# EAGLE board 辉光钟V2 (EAGLE 9.3.1)
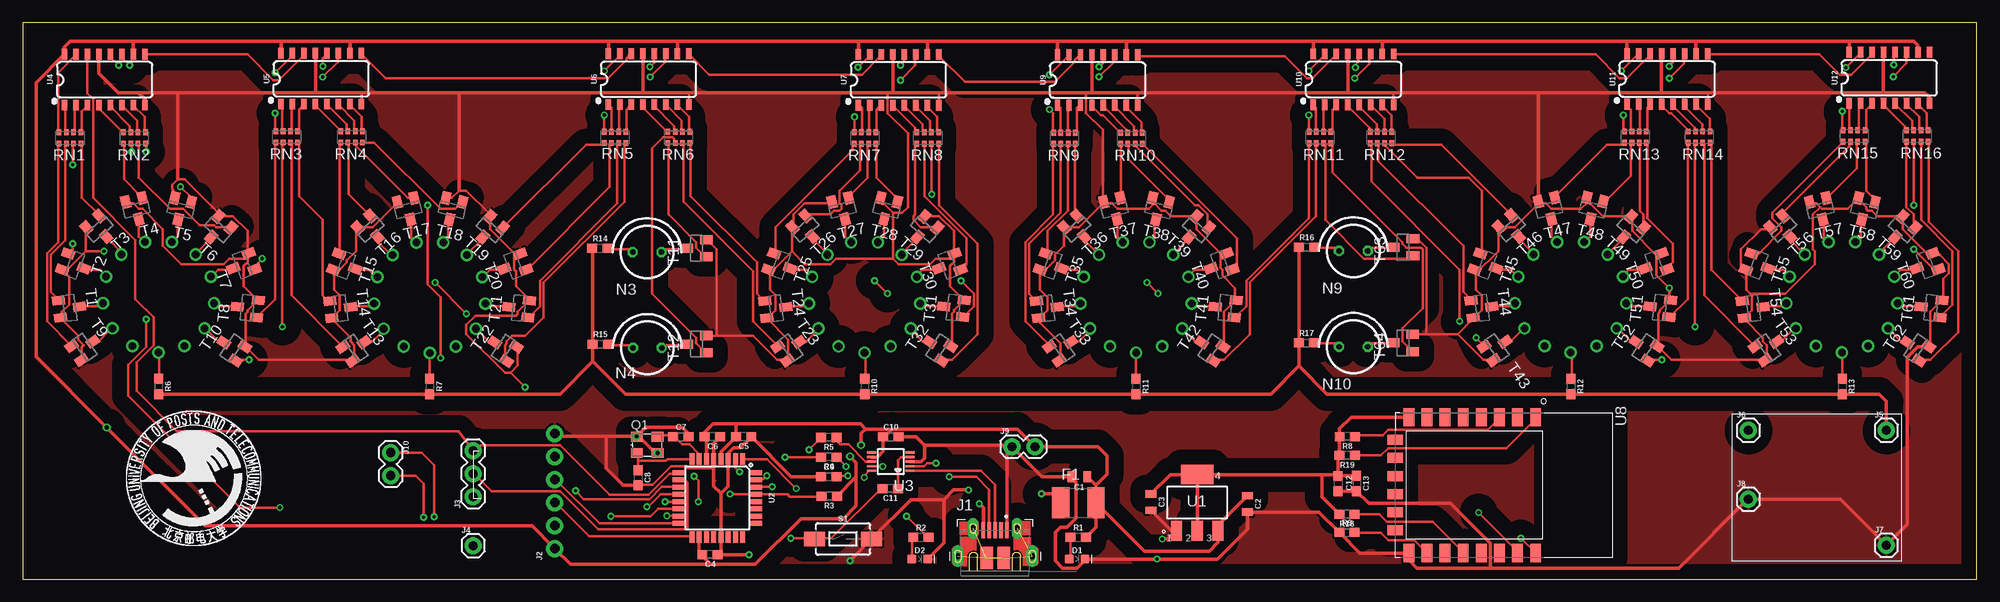
[diagram p5: board, top side]
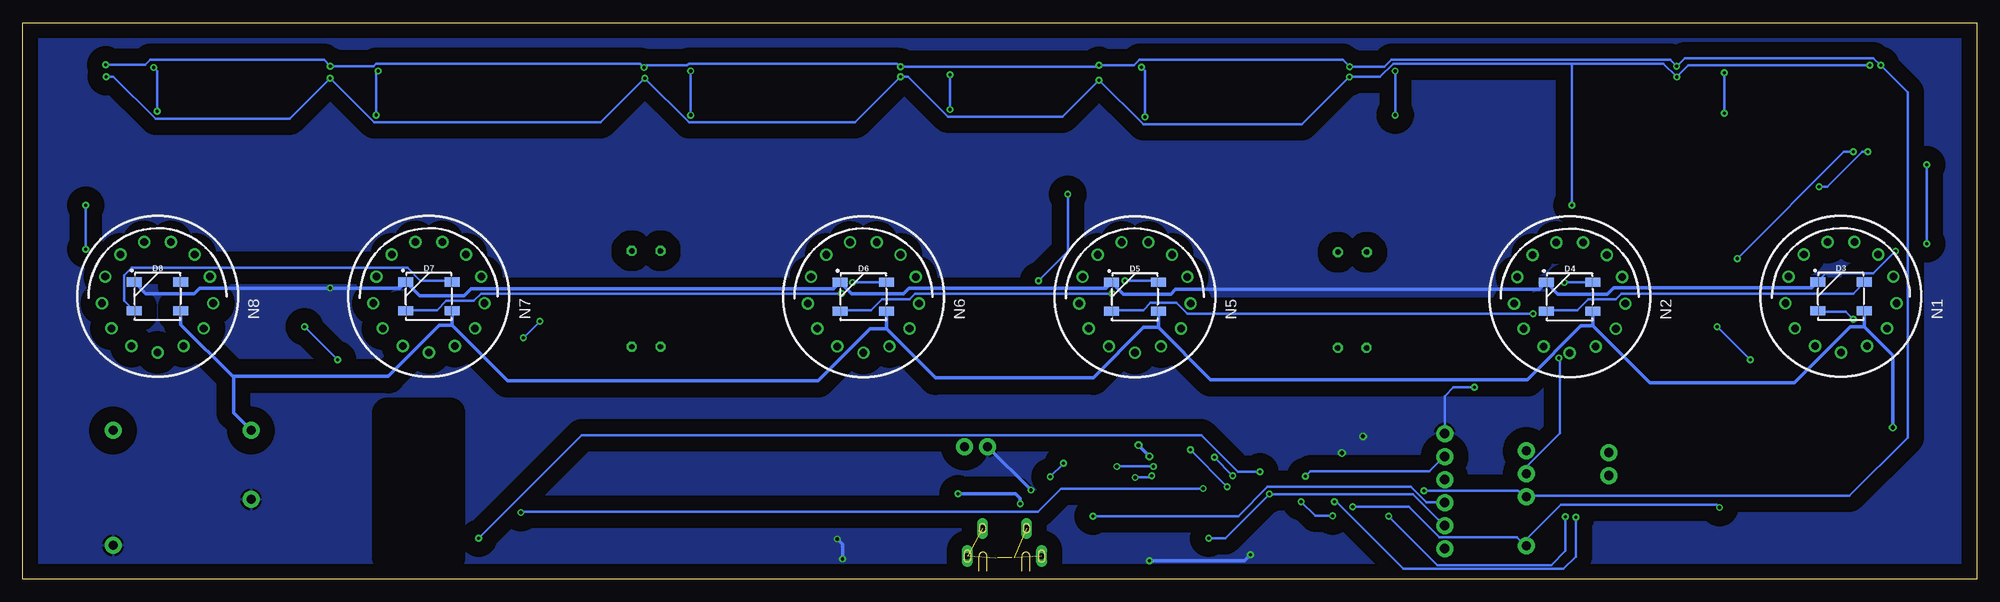
[diagram p6: board, bottom side, seen from below]

Size 215.9 x 61.47 mm. Coordinates in mm from the lower left corner, seen from the top.
Outline: 0,0 215.9,0 215.9,61.47 0,61.47 0,0
Copper layers (1*16): Top 0.035mm / dielectric 1.5mm / Bottom 0.035mm
Design rules "default *": minimum track width 10mil, minimum drill 0.35mm, track to track 6mil, track to pad 6mil, pad to pad 6mil, via to via 6mil, smd to smd 6mil, copper to edge 40mil, drill to drill 6mil, minimum pad ring 10mil, minimum via ring 8mil, stop-mask expansion 4mil, vias tented up to drill 0mil, thermal gap 10mil

## Footprints (pad centres in the part's own frame; a part is rotated, then mirrored left to right if it is on the bottom)
0805 = smd 0.8 x 1.2: 1 -0.9,0; 2 0.9,0
0603 = smd 1.1 x 1: 1 -0.85,0; 2 0.85,0
LED-0603 = smd 1 x 1: A -0.877,0; C 0.877,0
WS2812B = smd 1.651 x 1: 1 2.577,-1.6; 2 2.577,1.6; 3 -2.577,1.6; 4 -2.577,-1.6
FUSM1812X02 = smd 1.9 x 3.4: 1 -1.95,0; 2 1.95,0
AMPHENOL_10103592-0001LF = smd 0.4 x 1.75: 1 1.3,2.875; 2 0.65,2.875; 3 0,2.875; 4 -0.65,2.875; 5 -1.3,2.875 | drill 0.65 pad 0.8 long: P1 -2.425,3.08; P2 2.425,3.08 | drill 0.7 pad 1.05 long: P3 -4.1,0; P6 4.1,0 | smd 1.375 x 2.5: P4 -0.938,-0.2; P5 0.938,-0.2
1X06_NO_SILK = drill 1.016 pad 1.88: 1 0,0; 2 2.54,0; 3 5.08,0; 4 7.62,0; 5 10.16,0; 6 12.7,0
1X03 = drill 1.016 pad 1.88: 1 0,0; 2 2.54,0; 3 5.08,0
1X01 = drill 1.016 pad 1.88: 1 0,0
1X02 = drill 1.016 pad 1.88: 1 0,0; 2 2.54,0
IN-14 = drill 0.84: 0 5.094,-3.516; 1 -5.094,-3.516; 2 -6.145,-0.746; 3 -5.788,2.195; 4 -4.105,4.633; 5 -1.481,6.01; 6 1.481,6.01; 7 4.105,4.633; 8 5.788,2.195; 9 6.145,-0.746; A 0,-6.19; LHDP 2.877,-5.481; RHDP -2.877,-5.481
IN-3 = drill 0.6 octagon: A -1.587,0; K 1.587,0
3.2X2.5_KX-7 = smd 1.3 x 1.1: 1 -1.15,-0.9; 2 1.15,-0.9; 3 1.15,0.9; 4 -1.15,0.9
0603-ARC = smd 0.5 x 0.65: 1 -1.2,-0.625; 2 -0.4,-0.625; 3 0.4,-0.625; 4 1.2,-0.625; 5 1.2,0.625; 6 0.4,0.625; 7 -0.4,0.625; 8 -1.2,0.625
TACTILE_SWITCH_SMD_6.0X3.5MM = smd 2.3 x 1.6: 1 -3.15,0; 2 3.15,0
SOT23 = smd 1 x 1.4: 1 -0.95,-1.1; 2 0.95,-1.1; 3 0,1.1
SOT223 = smd 2.235 x 1.219: 1 -3.099,2.311; 2 -3.099,0; 3 -3.099,-2.311 | smd 2.2 x 3.6: 4 3.099,0
TQFP32-08 = smd 1.27 x 0.559: 1 -4.293,2.8; 2 -4.293,2; 3 -4.293,1.2; 4 -4.293,0.4; 5 -4.293,-0.4; 6 -4.293,-1.2; 7 -4.293,-2; 8 -4.293,-2.8; 17 4.293,-2.8; 18 4.293,-2; 19 4.293,-1.2; 20 4.293,-0.4; 21 4.293,0.4; 22 4.293,1.2; 23 4.293,2; 24 4.293,2.8 | smd 0.559 x 1.27: 9 -2.8,-4.293; 10 -2,-4.293; 11 -1.2,-4.293; 12 -0.4,-4.293; 13 0.4,-4.293; 14 1.2,-4.293; 15 2,-4.293; 16 2.8,-4.293; 25 2.8,4.293; 26 2,4.293; 27 1.2,4.293; 28 0.4,4.293; 29 -0.4,4.293; 30 -1.2,4.293; 31 -2,4.293; 32 -2.8,4.293
MSOP10 = smd 1 x 0.25: 1 -2.113,1; 2 -2.113,0.5; 3 -2.113,0; 4 -2.113,-0.5; 5 -2.113,-1; 6 2.113,-1; 7 2.113,-0.5; 8 2.113,0; 9 2.113,0.5; 10 2.113,1
SO16 = smd 0.6 x 1.2: 1 -4.445,-2.8; 2 -3.175,-2.8; 3 -1.905,-2.8; 4 -0.635,-2.8; 5 0.635,-2.8; 6 1.905,-2.8; 7 3.175,-2.8; 8 4.445,-2.8; 9 4.445,2.8; 10 3.175,2.8; 11 1.905,2.8; 12 0.635,2.8; 13 -0.635,2.8; 14 -1.905,2.8; 15 -3.175,2.8; 16 -4.445,2.8
XCVR_ESP8266-12E/ESP-12E = smd 2 x 1.2: 1 -7.5,7; 2 -7.5,5; 3 -7.5,3; 4 -7.5,1; 5 -7.5,-1; 6 -7.5,-3; 7 -7.5,-5; 8 -7.5,-7; 15 7.5,-7; 16 7.5,-5; 17 7.5,-3; 18 7.5,-1; 19 7.5,1; 20 7.5,3; 21 7.5,5; 22 7.5,7 | smd 1.1 x 1.7: 9 -5,-8.5; 10 -3,-8.5; 11 -1,-8.5; 12 1,-8.5; 13 3,-8.5; 14 5,-8.5

## Placement (x,y rotation side)
C1  22uF  [0805]  116.71,11.33 180 top
C2  22uF  [0805]  135.3,8.31 270 top
C3  22uF  [0805]  124.66,8.51 270 top
C4  100n  [0603]  75.94,2.72 180 top
C5  0.1uF  [0603]  79.65,15.73 180 top
C6  4.7uF  [0603]  76.21,15.72 180 top
C7  22pF  [0603]  72.72,15.72 0 top
C8  22pF  [0603]  67.99,11.2 270 top
C9  0.1uF  [0603]  89.06,11.33 0 top
C10  0.1uF  [0603]  95.91,15.72 0 top
C11  0.1uF  [0603]  95.86,10.01 180 top
C12  10uF  [0603]  145.31,10.54 270 top
C13  100n  [0603]  147.37,10.57 270 top
D1  [LED-0603]  116.5,2.22 0 top
D2  BLUE  [LED-0603]  99.11,2.22 0 top
D3  WS2812B  [WS2812B]  15.01,31.22 0 bottom
D4  WS2812B  [WS2812B]  44.98,31.17 0 bottom
D5  WS2812B  [WS2812B]  93.01,31.17 0 bottom
D6  WS2812B  [WS2812B]  123.01,31.2 0 bottom
D7  WS2812B  [WS2812B]  171.02,31.22 0 bottom
D8  WS2812B  [WS2812B]  200.99,31.22 0 bottom
F1  MF-MSMF050-2  [FUSM1812X02]  116.63,8.43 0 top
J1  10103592-0001LF  [AMPHENOL_10103592-0001LF]  107.43,2.54 0 top
J2  [1X06_NO_SILK]  58.8,3.38 90 top
J3  [1X03]  49.77,9.11 90 top
J4  [1X01]  49.77,3.69 0 top
J5  [1X01]  205.9,16.44 0 top
J6  [1X01]  190.66,16.44 0 top
J7  [1X01]  205.9,3.74 0 top
J8  [1X01]  190.66,8.82 0 top
J9  [1X02]  109.29,14.63 0 top
J10  [1X02]  40.66,13.99 270 top
N1  IN-14  [IN-14]  15.01,31.22 0 bottom
N2  IN-14  [IN-14]  44.98,31.17 0 bottom
N3  IN-3  [IN-3]  68.99,36.12 0 top
N4  IN-3  [IN-3]  69.01,25.55 0 top
N5  IN-14  [IN-14]  93.01,31.2 0 bottom
N6  IN-14  [IN-14]  123.01,31.2 0 bottom
N7  IN-14  [IN-14]  171.02,31.22 0 bottom
N8  IN-14  [IN-14]  200.99,31.22 0 bottom
N9  IN-3  [IN-3]  147.02,36.25 0 top
N10  IN-3  [IN-3]  147.02,25.67 0 top
Q1  [3.2X2.5_KX-7]  69.01,14.84 0 top
R1  1k  [0603]  116.63,4.61 0 top
R2  1k  [0603]  99.25,4.61 0 top
R3  10k  [0603]  89.1,9.17 180 top
R4  2.2k  [0603]  89.06,13.49 180 top
R5  2.2k  [0603]  89.06,15.65 180 top
R6  22k  [0603]  15.01,21.29 270 top
R7  22k  [0603]  44.98,21.29 270 top
R8  10k  [0603]  146.35,15.75 180 top
R9  10k  [0603]  146.3,5.16 0 top
R10  22k  [0603]  93.04,21.29 270 top
R11  22k  [0603]  123.01,21.29 270 top
R12  22k  [0603]  171.04,21.29 270 top
R13  22k  [0603]  201.02,21.29 270 top
R14  470  [0603]  63.78,36.54 0 top
R15  470  [0603]  63.83,25.96 0 top
R16  470  [0603]  141.86,36.67 0 top
R17  470  [0603]  141.83,26.09 0 top
R18  10k  [0603]  146.3,7.16 180 top
R19  10k  [0603]  146.33,13.67 180 top
RN1  [0603-ARC]  5.23,48.75 0 top
RN2  [0603-ARC]  12.34,48.75 0 top
RN3  [0603-ARC]  29.18,48.85 0 top
RN4  [0603-ARC]  36.35,48.85 0 top
RN5  [0603-ARC]  65.46,48.8 0 top
RN6  [0603-ARC]  72.49,48.8 0 top
RN7  [0603-ARC]  93.07,48.72 0 top
RN8  [0603-ARC]  100,48.72 0 top
RN9  [0603-ARC]  115.11,48.7 0 top
RN10  [0603-ARC]  122.5,48.7 0 top
RN11  [0603-ARC]  143.33,48.77 0 top
RN12  [0603-ARC]  150.06,48.77 0 top
RN13  [0603-ARC]  178.18,48.82 0 top
RN14  [0603-ARC]  185.22,48.82 0 top
RN15  [0603-ARC]  202.34,48.95 0 top
RN16  [0603-ARC]  209.32,48.95 0 top
S1  MOMENTARY-SWITCH-SPST-SMD-6.0X3.5MM  [TACTILE_SWITCH_SMD_6.0X3.5MM]  90.64,4.44 0 top
T1  A42  [SOT23]  5.18,29.95 277 top
T2  A42  [SOT23]  5.74,34.7 250 top
T3  A42  [SOT23]  8.48,38.64 222 top
T4  A42  [SOT23]  12.57,40.82 194 top
T5  A42  [SOT23]  17.45,40.8 166 top
T6  A42  [SOT23]  21.56,38.59 138 top
T7  A42  [SOT23]  24.28,34.73 110 top
T8  A42  [SOT23]  24.84,29.98 84 top
T9  A42  [SOT23]  6.86,25.61 305 top
T10  A42  [SOT23]  23.14,25.53 56 top
T11  A42  [SOT23]  74.45,36.54 90 top
T12  A42  [SOT23]  74.45,25.96 90 top
T13  A42  [SOT23]  36.83,25.53 305 top
T14  A42  [SOT23]  35.15,29.9 277 top
T15  A42  [SOT23]  35.69,34.68 250 top
T16  A42  [SOT23]  38.46,38.64 222 top
T17  A42  [SOT23]  42.6,40.8 194 top
T18  A42  [SOT23]  47.42,40.8 166 top
T19  A42  [SOT23]  51.59,38.59 138 top
T20  A42  [SOT23]  54.25,34.68 110 top
T21  A42  [SOT23]  54.81,29.95 84 top
T22  A42  [SOT23]  53.09,25.51 56 top
T23  A42  [SOT23]  84.86,25.56 305 top
T24  A42  [SOT23]  83.21,29.9 277 top
T25  A42  [SOT23]  83.74,34.7 250 top
T26  A42  [SOT23]  86.51,38.66 222 top
T27  A42  [SOT23]  90.6,40.82 194 top
T28  A42  [SOT23]  95.45,40.82 166 top
T29  A42  [SOT23]  99.59,38.61 138 top
T30  A42  [SOT23]  102.26,34.7 110 top
T31  A42  [SOT23]  102.84,30 84 top
T32  A42  [SOT23]  101.12,25.56 56 top
T33  A42  [SOT23]  114.88,25.56 305 top
T34  A42  [SOT23]  113.21,29.93 277 top
T35  A42  [SOT23]  113.74,34.7 250 top
T36  A42  [SOT23]  116.51,38.66 222 top
T37  A42  [SOT23]  120.62,40.82 194 top
T38  A42  [SOT23]  125.48,40.8 166 top
T39  A42  [SOT23]  129.62,38.59 138 top
T40  A42  [SOT23]  132.31,34.73 110 top
T41  A42  [SOT23]  132.87,29.98 84 top
T42  A42  [SOT23]  131.17,25.53 56 top
T43  A42  [SOT23]  162.89,25.58 305 top
T44  A42  [SOT23]  161.21,29.95 277 top
T45  A42  [SOT23]  161.75,34.7 250 top
T46  A42  [SOT23]  164.54,38.69 222 top
T47  A42  [SOT23]  168.63,40.85 194 top
T48  A42  [SOT23]  173.46,40.85 166 top
T49  A42  [SOT23]  177.65,38.61 138 top
T50  A42  [SOT23]  180.31,34.73 110 top
T51  A42  [SOT23]  180.87,30 84 top
T52  A42  [SOT23]  179.15,25.56 56 top
T53  A42  [SOT23]  192.86,25.58 305 top
T54  A42  [SOT23]  191.19,29.93 277 top
T55  A42  [SOT23]  191.74,34.7 250 top
T56  A42  [SOT23]  194.51,38.66 222 top
T57  A42  [SOT23]  198.6,40.8 194 top
T58  A42  [SOT23]  203.45,40.8 166 top
T59  A42  [SOT23]  207.62,38.59 138 top
T60  A42  [SOT23]  210.29,34.73 110 top
T61  A42  [SOT23]  210.85,29.98 84 top
T62  A42  [SOT23]  209.14,25.53 56 top
T63  A42  [SOT23]  152.5,36.67 90 top
T64  A42  [SOT23]  152.48,26.09 90 top
U1  LD1117S33CTR  [SOT223]  129.77,8.46 90 top
U2  ATMEGA328P_TQFP  [TQFP32-08]  76.76,8.97 270 top
U3  CH340ESMD  [MSOP10]  95.91,12.98 180 top
U4  SN74HC595D  [SO16]  9.07,55.17 0 top
U5  SN74HC595D  [SO16]  32.99,55.28 0 top
U6  SN74HC595D  [SO16]  69.16,55.23 0 top
U7  SN74HC595D  [SO16]  96.77,55.15 0 top
U8  ESP8266-12E/ESP-12E  [XCVR_ESP8266-12E/ESP-12E]  160.14,10.39 270 top
U9  SN74HC595D  [SO16]  118.77,55.12 0 top
U10  SN74HC595D  [SO16]  147.04,55.2 0 top
U11  SN74HC595D  [SO16]  181.69,55.25 0 top
U12  SN74HC595D  [SO16]  206.22,55.38 0 top

## Tracks (layer width: path | path; a pad name or v marks a point on that pad's centre or on a via)
1-1
  Top 0.254: RN1.8 3.91,49.43 3.91,55.93 5.94,57.96 U4.15
1-2
  Top 0.254: RN1.7 4.72,49.43 4.72,52.27 U4.1
1-3
  Top 0.254: RN1.6 5.74,49.43 5.74,52.27 U4.2
1-4
  Top 0.254: RN1.5 6.55,49.43 6.55,51.66 7.16,52.27 U4.3
1-5
  Top 0.254: RN2.8 11.02,49.43 8.59,51.87 8.59,52.27 U4.4
1-6
  Top 0.254: RN2.7 11.84,49.43 11.84,50.04 9.6,52.27 U4.5
1-7
  Top 0.254: RN2.6 12.65,49.43 12.65,50.65 11.02,52.27 U4.6
1-8
  Top 0.254: RN2.5 13.46,49.43 13.46,51.05 12.24,52.27 U4.7
2-1  (via drill 0.35)
  Top 0.254: v27.89,51.46 27.89,49.63 RN3.8 | v27.89,55.93 29.92,57.96 U5.15
  Bottom 0.254: v27.89,55.93 v27.89,51.46
2-2
  Top 0.254: RN3.7 28.7,49.63 28.7,52.27 U5.1
2-3
  Top 0.254: RN3.6 29.72,49.63 29.72,52.27 U5.2
2-4
  Top 0.254: RN3.5 30.53,49.63 30.53,51.87 30.94,52.27 U5.3
2-5
  Top 0.254: RN4.8 35,49.63 32.36,52.27 U5.4
2-6
  Top 0.254: RN4.7 35.81,49.63 35.81,50.24 33.78,52.27 U5.5
2-7
  Top 0.254: RN4.6 36.63,49.63 36.63,50.65 35,52.27 U5.6
2-8
  Top 0.254: RN4.5 37.44,49.63 37.44,51.05 36.22,52.27 U5.7
3  (via drill 0.35)
  Top 0.254: U2.1 82.22,13.26 v85.47,10.01 | v160.85,7.37 165.33,2.9 U8.21
  Bottom 0.254: v85.47,10.01 101.17,10.01 103.72,7.46 160.76,7.46 v160.85,7.37
3-1  (via drill 0.35)
  Top 0.254: v64.26,51.26 RN5.8 | v64.26,56.13 66.09,57.96 U6.15
  Bottom 0.254: v64.26,56.13 v64.26,51.26
3-2
  Top 0.254: RN5.7 65.07,49.43 65.07,52.07 64.87,52.27 U6.1
3-3
  Top 0.254: RN5.6 65.89,49.43 65.89,52.27 U6.2
3-4
  Top 0.254: RN5.5 66.7,49.43 66.7,51.87 67.11,52.27 U6.3
3-5
  Top 0.254: U6.4 68.53,52.07 71.17,49.43 RN6.8
3-6
  Top 0.254: RN6.7 71.98,49.43 71.98,50.04 69.75,52.27 U6.5
3-7
  Top 0.254: RN6.6 72.8,49.43 72.8,50.65 71.17,52.27 U6.6
3-8
  Top 0.254: RN6.5 73.61,49.43 73.61,51.05 72.39,52.27 U6.7
3.3V
  Top 0.406: U1.2 U1.4 | U1.4 126.81,11.56 C3.1 | U1.4 143.52,11.56 | 143.52,11.56 145.14,11.56 C12.1 | C12.1 145.31,13.5 R19.2 145.48,15.72 R8.2 145.5,16.6 146.79,17.89 U8.8 | C13.1 145.34,11.42 C12.1 | R18.2 143.52,9.1 143.52,11.56
4  (via drill 0.35)
  Top 0.254: v79.21,11.85 78.76,12.3 U2.2 | v165.53,4.52 167.15,2.9 U8.22
  Bottom 0.254: v79.21,11.85 81.62,11.85 85.67,15.9 154.15,15.9 v165.53,4.52
4-1  (via drill 0.35)
  Top 0.254: v91.9,51.05 91.9,49.43 RN7.8 | v92.3,56.54 93.52,57.76 U7.15
  Bottom 0.254: v91.9,51.05 91.9,56.13 v92.3,56.54
4-2
  Top 0.254: RN7.7 92.71,49.43 92.71,52.07 92.51,52.27 U7.1
4-3
  Top 0.254: RN7.6 93.52,49.43 93.52,52.27 U7.2
4-4
  Top 0.254: RN7.5 94.34,49.43 94.34,51.87 94.74,52.27 U7.3
4-5
  Top 0.254: RN8.8 98.6,49.43 98.6,49.84 96.16,52.27 U7.4
4-6
  Top 0.254: RN8.7 99.42,49.43 99.42,50.24 97.38,52.27 U7.5
4-7
  Top 0.254: RN8.6 100.23,49.43 100.23,50.65 98.6,52.27 U7.6
4-8
  Top 0.254: RN8.5 101.04,49.43 101.04,51.05 99.82,52.27 U7.7
5
  Top 0.254: U4.14 7.16,53.7 7.77,53.09 7.77,42.11 12.45,37.44 12.45,30.94 14.48,28.9 14.48,25.86 12.58,23.96 12.58,20.79 17.03,16.35 48.18,16.35 J3.3 50.71,14.81 59.4,14.81 64.85,9.35 69.16,9.35 71.45,11.64 72.46,11.64 U2.9
5-1  (via drill 0.35)
  Top 0.254: v113.44,51.87 113.84,51.46 113.84,49.43 RN9.8 | v113.44,55.73 115.47,57.76 U9.15
  Bottom 0.254: v113.44,55.73 v113.44,51.87
5-2
  Top 0.254: RN9.7 114.66,49.43 114.66,52.07 114.45,52.27 U9.1
5-3
  Top 0.254: RN9.6 115.47,49.43 115.47,52.27 U9.2
5-4
  Top 0.254: RN9.5 116.48,49.43 116.48,52.07 116.69,52.27 U9.3
5-5
  Top 0.254: RN10.8 121.16,49.43 119.33,51.26 119.13,51.26 118.11,52.27 U9.4
5-6
  Top 0.254: RN10.7 121.97,49.43 121.97,49.63 119.33,52.27 U9.5
5-7
  Top 0.254: RN10.6 122.78,49.43 122.78,50.04 120.55,52.27 U9.6
5-8
  Top 0.254: RN10.5 123.6,49.43 123.6,50.44 121.77,52.27 U9.7
5V  (via drill 0.45)
  Top 0.406: F1.2 118.58,10.36 | 118.58,10.36 C1.1 | F1.2 118.58,5.71 R1.2 | 118.58,10.36 119.79,11.56 119.79,13.63 118.79,14.63 J9.2 109.88,16.58 96.06,16.58 | F1.2 123.91,3.11 131.09,3.11 132.08,4.1 U1.3 132.08,5.98 C2.1 | 96.06,16.58 95.21,15.72 C10.1 95.06,14.12 94.42,13.48 U3.7 | R3.1 92.08,11.3 | 93.1,16.58 96.06,16.58 | U2.6 75.56,15.53 C6.2 75.36,16.22 76.28,17.14 78.97,17.14 | U2.4 77.16,14.09 C5.2 78.8,16.97 78.97,17.14 | U2.18 74.76,3.06 C4.2 75.09,2.52 75.98,1.63 | 78.97,17.14 92.54,17.14 93.1,16.58 | 75.98,1.63 80.93,1.63 85.98,6.69 90.68,6.69 92.08,8.09 92.08,11.3 | 75.98,1.63 60.54,1.63 J2.1 56.3,5.88 20.16,5.88 v9.29,16.75 1.49,24.55 1.49,54.84 U4.16 4.62,58.76 5.26,59.4 12.25,59.4 | 12.25,59.4 28.54,59.4 | 28.54,59.4 36.19,59.4 | 36.19,59.4 64.75,59.4 | 64.75,59.4 72.32,59.4 | 72.32,59.4 92.33,59.4 | 92.33,59.4 99.95,59.4 | 99.95,59.4 114.32,59.4 | 114.32,59.4 121.99,59.4 | 121.99,59.4 142.58,59.4 | 142.58,59.4 150.23,59.4 | 150.23,59.4 177.26,59.4 | 177.26,59.4 184.88,59.4 | 184.88,59.4 201.8,59.4 | 201.8,59.4 208.95,59.4 209.4,58.95 U12.10 | U12.16 201.78,59.38 201.8,59.4 | U11.10 184.86,59.38 184.88,59.4 | U11.16 177.24,59.38 177.26,59.4 | U10.10 150.22,59.38 150.23,59.4 | U10.16 142.6,59.38 142.58,59.4 | U9.10 121.94,59.35 121.99,59.4 | U9.16 114.32,59.39 114.32,59.4 | U7.10 99.95,59.4 | U7.16 92.33,59.4 | U6.10 72.34,59.38 72.32,59.4 | U6.16 64.72,59.37 64.75,59.4 | U5.10 36.17,59.38 36.19,59.4 | U5.16 28.55,59.39 28.54,59.4 | U4.10 12.24,59.39 12.25,59.4 | 92.08,11.3 92.08,12.88 v91.4,13.56 | v92.63,14.81 92.63,16.11 93.1,16.58
  Bottom 0.406: D3.1 12.43,27.87 | v9.29,16.75 9.29,24.73 12.43,27.87 | 12.43,27.87 14,27.87 20.16,21.71 36.15,21.71 42.41,27.96 | D4.1 42.41,27.96 | 42.41,27.96 43.72,27.96 49.66,22.03 84.67,22.03 90.44,27.8 | 90.44,27.8 D5.1 | 90.44,27.8 92.05,27.8 97.61,22.24 115.05,22.24 120.45,27.64 | 120.45,27.64 120.45,29.58 D6.1 | 120.45,27.64 122.3,27.64 128,21.94 162.34,21.94 168.44,28.04 | 168.44,28.04 D7.1 | 168.44,28.04 169.86,28.04 175.5,22.4 192.59,22.4 | 192.59,22.4 192.72,22.4 198.41,28.09 D8.1 | J6.1 192.59,18.37 192.59,22.4 | v91.4,13.56 92.63,14.79 v92.63,14.81
6  (via drill 0.35)
  Top 0.254: U2.10 73.14,10.96 73.48,10.62 73.48,5.74 73.28,5.54 63.59,5.54 59.4,9.73 51.82,9.73 49.91,11.64 J3.2 | v11.84,56.74 11.02,57.56 11.02,57.96 U4.11 | v33.15,55.47 34.8,57.11 34.8,57.96 U5.11 | v69.33,55.47 70.97,57.1 70.97,57.96 U6.11 | v96.98,55.12 98.6,56.74 98.6,57.76 U7.11 | v118.91,55.48 120.55,57.11 120.55,57.76 U9.11 | v147.17,55.32 148.79,56.95 148.79,57.96 U10.11 | v181.91,55.32 183.54,56.95 183.54,57.96 U11.11 | U12.11 208.13,56.97 v206.65,55.5 | v46.18,24.43 46.18,31.14 44.76,32.56 v44.76,41.3
  Bottom 0.254: v11.84,56.74 31.88,56.74 v33.15,55.47 34.63,56.95 44.76,56.95 | 44.76,56.95 64.47,56.95 65.94,55.47 v69.33,55.47 74.56,50.24 92.1,50.24 v96.98,55.12 101.04,51.05 113.64,51.05 118.06,55.48 v118.91,55.48 123.95,50.44 142.29,50.44 v147.17,55.32 152.04,50.44 177.04,50.44 v181.91,55.32 186.38,50.85 201.22,50.85 205.87,55.5 v206.65,55.5 | v46.18,24.43 46.05,24.31 46.05,16.11 49.71,12.45 49.71,11.84 J3.2 | 44.76,56.95 v44.76,41.3
6-1  (via drill 0.35)
  Top 0.254: v142.09,51.26 142.09,49.43 RN11.8 | v142.09,56.13 143.92,57.96 U10.15
  Bottom 0.254: v142.09,56.13 v142.09,51.26
6-2
  Top 0.254: RN11.7 142.9,49.43 142.9,52.07 142.7,52.27 U10.1
6-3
  Top 0.254: RN11.6 143.71,49.43 143.71,52.27 U10.2
6-4
  Top 0.254: RN11.5 144.73,49.43 144.73,51.87 145.14,52.27 U10.3
6-5
  Top 0.254: RN12.8 148.79,49.43 148.79,49.84 146.35,52.27 U10.4
6-6
  Top 0.254: RN12.7 149.61,49.43 149.61,50.24 147.57,52.27 U10.5
6-7
  Top 0.254: RN12.6 150.42,49.43 150.42,50.85 149,52.27 U10.6
6-8
  Top 0.254: RN12.5 151.23,49.43 151.23,51.26 150.22,52.27 U10.7
7  (via drill 0.35)
  Top 0.254: U2.11 72.45,10.18 70.6,10.18 69.28,8.85 62,8.85 v61.1,9.75 | v10.62,56.74 9.8,57.56 9.8,57.96 U4.12 | v33.17,56.66 33.17,57.56 33.58,57.96 U5.12 | v69.29,56.58 69.75,57.04 69.75,57.96 U6.12 | v96.98,56.74 97.38,57.15 97.38,57.76 U7.12 | v118.92,56.58 119.33,56.99 119.33,57.76 U9.12 | v147.24,56.51 147.24,56.82 147.57,57.16 147.57,57.96 U10.12 | U11.12 182.32,57.07 v181.91,56.65 | v206.72,56.81 206.72,58.17 U12.12
  Bottom 0.254: v61.1,9.75 50.73,9.75 J3.1 49.71,9.2 14.07,9.2 7.64,15.62 7.64,53.77 v10.62,56.74 11.43,57.56 32.28,57.56 v33.17,56.66 33.86,57.35 64.67,57.35 65.44,56.58 v69.29,56.58 70.06,57.35 92.51,57.35 93.12,56.74 v96.98,56.74 97.14,56.58 v118.92,56.58 119.29,56.95 142.29,56.95 142.47,56.76 146.99,56.76 v147.24,56.51 147.67,56.95 176.83,56.95 177.13,56.65 v181.91,56.65 182.6,57.35 201.83,57.35 202.38,56.81 v206.72,56.81
7-1  (via drill 0.35)
  Top 0.254: v176.83,51.26 176.83,49.63 RN13.8 | v176.63,56.13 178.46,57.96 U11.15
  Bottom 0.254: v176.83,51.26 176.83,55.93 v176.63,56.13
7-2
  Top 0.254: RN13.7 177.65,49.63 177.65,51.87 177.24,52.27 U11.1
7-3
  Top 0.254: RN13.6 178.66,49.63 178.66,52.27 U11.2
7-4
  Top 0.254: RN13.5 179.48,49.63 179.48,52.07 179.68,52.27 U11.3
7-5
  Top 0.254: RN14.8 183.95,49.63 182.12,51.46 181.91,51.46 181.1,52.27 U11.4
7-6
  Top 0.254: RN14.7 184.76,49.63 184.76,49.84 182.32,52.27 U11.5
7-7
  Top 0.254: RN14.6 185.57,49.63 185.57,50.24 183.54,52.27 U11.6
7-8
  Top 0.254: RN14.5 186.38,49.63 186.38,50.85 184.96,52.27 U11.7
8  (via drill 0.35)
  Top 0.254: v68.96,8.01 69.1,8.01 70.46,9.37 U2.12 | v13.66,28.7 13.66,25.65 11.67,23.66 11.67,20.25 24.01,7.91 v28.42,7.91
  Bottom 0.254: v68.96,8.01 62.76,8.01 59.4,4.65 50.84,4.65 49.91,3.71 J4.1 49.77,4.39 45.94,8.22 28.73,8.22 v28.42,7.91 | v13.66,28.7 14.48,29.52 17.53,29.52 D3.4
8-1  (via drill 0.35)
  Top 0.254: v201.02,51.66 201.02,49.63 RN15.8 | v201.41,56.51 203.05,58.14 U12.15
  Bottom 0.254: v201.02,51.66 201.02,56.11 v201.41,56.51
8-2
  Top 0.254: RN15.7 201.83,49.63 201.83,52.48 U12.1
8-3
  Top 0.254: RN15.6 202.84,49.63 202.84,52.27 203.05,52.48 U12.2
8-4
  Top 0.254: RN15.5 203.66,49.63 203.66,51.87 204.27,52.48 U12.3
8-5
  Top 0.254: RN16.8 207.92,49.63 207.92,50.04 205.49,52.48 U12.4
8-6
  Top 0.254: RN16.7 208.74,49.63 208.74,50.65 206.91,52.48 U12.5
8-7
  Top 0.254: RN16.6 209.55,49.63 209.55,51.05 208.13,52.48 U12.6
8-8
  Top 0.254: RN16.5 210.36,49.63 210.36,51.46 209.35,52.48 U12.7
9  (via drill 0.35)
  Top 0.254: U2.13 71.01,8.57 v70.99,8.55 | v44.32,6.85 44.32,10.56 43.43,11.45 J10.2
  Bottom 0.254: v70.99,8.55 70.77,8.55 63.37,1.15 45.67,1.15 44.32,2.5 v44.32,6.85
10  (via drill 0.35)
  Top 0.254: U2.14 70.19,7.77 69.37,6.95 v65,6.95 v64.99,6.96 | v45.45,6.9 45.45,12.58 44.06,13.97 40.68,13.97 J10.1
  Bottom 0.254: v64.99,6.96 59.59,1.55 54.46,1.55 54.29,1.55 47.03,1.55 45.45,3.14 v45.45,6.9
11  (via drill 0.35)
  Top 0.254: v71.16,6.98 72.46,6.98 U2.15 | v74.65,8.56 74.65,10.89 v74.18,11.36
  Bottom 0.254: v71.16,6.98 73.08,6.98 v74.65,8.56 | v74.18,11.36 73.65,11.89 60.48,11.89 58.99,13.38 J2.5
12
  Top 0.254: J2.4 58.88,11 63.74,6.15 72.46,6.15 U2.16
13  (via drill 0.35)
  Top 0.254: v97.66,6.96 99.89,4.73 R2.2 | U2.17 73.89,4.73 62.57,4.73 58.99,8.3 J2.3
  Bottom 0.254: v97.66,6.96 81.61,6.96 78.36,10.21 62.53,10.21 60.82,8.51 58.99,8.51 J2.3
GND  (via drill 0.35, 0.45)
  Top 0.254: 54.3,36.02 54.91,36.02 T20.2 54.3,36.02 | 54.3,36.02 51.66,38.66 51.66,39.88 T19.2 51.46,40.08 51.46,40.49 49.02,42.93 48.21,42.93 47.4,42.11 46.79,42.11 T18.2 | 76.36,12.24 73.48,12.24 73.28,12.45 71.65,12.45 69.62,10.42 67.99,10.42 C8.2 | 53.9,22.81 54.71,23.62 54.71,25.65 T22.2 | 53.9,22.81 53.29,22.81 49.02,27.08 49.02,28.09 50.04,29.11 54.51,29.11 54.71,29.31 54.71,29.52 55.93,30.73 T21.2 55.93,30.94 54.51,32.36 54.51,33.98 54.3,34.19 54.3,36.02 | 53.9,22.81 v55.52,21.18 | T17.2 41.3,41.5 38.66,38.86 37.03,38.86 T16.2 36.83,38.66 36.83,36.22 35.81,35.2 35.81,35 35,34.19 34.39,34.19 T15.2 34.39,33.98 34.39,31.95 35,31.34 35,29.72 34.19,28.9 T14.2 34.19,28.7 36.22,26.67 36.22,26.26 36.63,25.86 36.63,24.23 T13.2 36.42,24.23 26.06,24.23 24.64,25.65 T10.2 24.64,25.86 24.64,29.31 24.84,29.52 24.84,29.72 25.86,30.73 T8.2 25.86,30.94 24.44,32.36 24.44,34.59 24.84,35 24.84,35.41 | 24.84,35.41 24.84,35.81 T7.2 24.84,36.02 24.84,38.46 23.22,40.08 22,40.08 | 22,40.08 21.79,40.08 T6.2 22,40.08 | 24.84,35.41 22.81,35.41 22.2,34.8 17.53,34.8 15.49,36.83 15.49,38.66 13.26,40.89 12.85,40.89 12.24,41.5 11.43,41.5 T4.2 | 22,40.08 17.93,44.14 17.12,44.14 16.51,43.54 16.51,43.13 16.71,42.93 16.71,42.11 T5.2 | T32.2 102.67,25.86 102.67,29.31 102.87,29.52 102.87,29.72 103.89,30.73 T31.2 103.89,30.94 102.46,32.36 102.46,34.59 102.87,35 102.87,35.41 | 102.87,35.41 102.87,35.81 T30.2 | T29.2 99.82,40.08 101.24,40.08 102.87,38.46 102.87,36.02 T30.2 | 96.16,40.49 94.94,41.71 94.94,42.11 T28.2 | 96.16,35.41 96.16,40.49 | 96.16,35.41 96.77,34.8 100.23,34.8 100.84,35.41 102.87,35.41
  Top 0.254: 102.87,35.41 T30.2 | 84.99,36.22 82.96,34.19 82.55,34.19 T25.2 82.55,33.98 82.55,31.95 83.16,31.34 83.16,29.72 82.35,28.9 T24.2 82.35,28.7 84.58,26.47 84.58,24.23 T23.2 84.38,24.23 83.36,24.23 80.72,26.87 76.66,26.87 | 84.99,36.22 84.99,38.66 T26.2 85.19,38.86 85.19,40.28 86.41,41.5 89.26,41.5 T27.2 | 76.66,26.87 75.64,26.87 T12.2 | 76.66,26.87 76.66,36.42 75.64,37.44 T11.2 | 96.16,35.41 89.87,35.41 89.26,34.8 86.41,34.8 84.99,36.22 | T33.2 114.66,24.23 114.66,26.06 112.42,28.3 112.42,28.7 T34.2 112.42,28.9 113.23,29.72 113.23,31.14 112.42,31.95 112.42,33.98 T35.2 112.42,34.19 113.03,34.19 114.05,35.2 114.05,35.81 115.06,36.83 115.06,38.66 T36.2 115.26,38.86 116.69,38.86 119.33,41.5 T37.2 | T42.2 132.74,25.86 132.74,29.52 133.96,30.73 T41.2 133.96,30.94 133.96,32.16 132.54,33.58 132.54,34.19 132.33,34.39 132.33,36.02 | 132.33,36.02 132.94,36.02 T40.2 132.33,36.02 | 132.33,36.02 129.69,38.66 129.69,39.88 T39.2 129.49,40.08 126.85,40.08 126.24,40.69 125.83,40.69 125.02,41.5 | 125.02,41.5 125.02,41.91 T38.2 125.02,41.5 | 125.02,41.5 124.41,40.89 120.95,40.89 120.34,41.5 119.53,41.5 T37.2 | 101.24,53.75 101.24,52.48 U7.8 | 123.19,53.75 123.19,52.48 U9.8 | 151.44,53.75 151.44,52.48 U10.8 | 73.61,53.75 U6.8 | 186.18,53.75 186.18,52.48 U11.8 | 37.44,53.75 U5.8 | 117.5,53.75 117.5,51.46 119.33,49.63 119.33,41.71 T37.2 | 96.16,40.49 97.18,40.49 97.79,41.1 97.79,49.23 95.56,51.46 95.56,53.75 | 117.37,2.08 D1.C | 115.86,11.29 C1.2 | 135.45,7.37 C2.2 | 198.58,41.1 198.78,40.89 201.62,40.89 202.64,41.91 T58.2 202.84,41.91 203.66,41.1 203.66,40.89 203.86,40.69 204.27,40.69 204.88,40.08 207.52,40.08 T59.2 207.72,39.88 207.72,38.66 210.36,36.02 210.97,36.02 T60.2 211.18,35.81 211.78,35.81 212.8,34.8 212.8,33.78 212.19,33.17 212.19,30.94 T61.2 211.99,30.73 210.77,29.52 210.77,25.86 T62.2 210.57,25.65
  Top 0.254: 198.58,41.1 198.17,41.5 197.56,41.5 T57.2 | 167.49,41.5 164.85,38.86 163.22,38.86 T46.2 163.02,38.86 163.02,36.22 160.58,33.78 | 158.55,27.08 155.09,27.08 | 155.09,27.08 153.67,27.08 T64.2 | 158.55,27.08 160.17,28.7 T44.2 160.38,28.9 161.19,29.72 161.19,31.34 160.58,31.95 160.58,33.78 | 158.55,27.08 161.39,24.23 162.41,24.23 T43.2 | 160.58,33.78 160.58,33.98 T45.2 160.58,33.78 | 155.09,27.08 155.09,36.63 154.28,37.44 153.67,37.44 T63.2 | T9.2 6.55,24.23 6.55,25.65 6.76,25.86 6.15,26.47 6.15,26.87 4.32,28.7 T1.2 4.32,28.9 4.32,29.52 5.13,30.33 5.13,33.38 4.52,33.98 T2.2 4.52,34.19 4.93,34.19 6.96,36.22 | 6.96,36.22 6.96,38.66 T3.2 | v8.99,36.22 6.96,36.22 | 190.86,31.55 191.06,31.34 191.06,29.72 190.25,28.9 T54.2 190.25,28.7 192.28,26.67 192.28,26.26 192.68,25.86 192.68,24.23 T53.2 192.48,24.23 182.12,24.23 180.7,25.65 T52.2 180.7,25.86 180.7,29.31 180.9,29.52 180.9,29.72 181.91,30.73 T51.2 181.91,30.94 v181.91,32.16 180.49,33.58 180.49,36.02 | 190.86,31.55 190.45,31.95 190.45,33.98 T55.2 190.25,34.19 189.84,34.59 189.84,36.42 192.07,38.66 192.89,38.66 T56.2 | 180.49,36.02 180.9,36.02 T50.2 180.49,36.02 | 180.49,36.02 180.29,36.02 177.85,38.46 177.85,39.88 T49.2 177.65,40.08 174.6,40.08 172.97,41.71 | 172.97,41.71 172.97,42.11 T48.2 172.97,41.71 | 167.49,41.5 168.3,41.5 168.91,40.89 172.16,40.89 172.97,41.71 | 167.49,41.5 T47.2 | 198.58,41.1 197.76,40.28 197.76,36.42 197.97,36.22 197.97,34.8 194.72,31.55 190.86,31.55
  Top 0.406: C6.1 76.36,15.02 U2.5 76.36,12.24 76.36,10.26 77.16,9.46 | 101.77,8.79 98.14,8.79 S1.2 v91.4,2.05 | D2.C 101.77,4.01 101.77,8.79 | U3.3 99.26,12.98 99.66,13.38 99.66,14.77 | C10.2 98.7,15.72 99.66,14.77 | 99.66,14.77 109.16,14.77 | 109.16,14.77 J9.1 112.63,11.29 115.86,11.29 | C9.1 84.91,11.33 C5.1 79.26,14.49 78.52,14.49 77.96,13.92 U2.3 77.96,10.26 77.16,9.46 | 77.16,9.46 U2.21 77.16,3.08 C4.1 80.22,2.72 v80.25,2.69 | v70.16,13.94 69.88,13.94 68.05,15.77 v67.81,15.77 | U4.13 8.43,55.87 10.55,53.75 12.79,53.75 | 12.79,53.75 13.52,53.02 U4.8 | 12.79,53.75 17.06,53.75 | 17.06,53.75 32.35,53.75 | 32.35,53.75 37.44,53.75 48.23,53.75 | 48.23,53.75 68.53,53.75 | 68.53,53.75 73.61,53.75 95.56,53.75 96.15,53.75 | 96.15,53.75 101.24,53.75 117.5,53.75 118.15,53.75 | 118.15,53.75 123.19,53.75 146.44,53.75 | 146.44,53.75 151.44,53.75 167.45,53.75 | 167.45,53.75 181.07,53.75 | 181.07,53.75 186.18,53.75 205.59,53.75 | 205.59,53.75 210.17,53.75 210.68,53.24 210.67,53.23 U12.8 | U12.13 205.59,53.75 | U11.13 181.05,53.77 181.07,53.75 | U10.13 146.41,53.78 146.44,53.75 | U9.13 118.13,53.76 118.15,53.75 | U7.13 96.15,53.75 | U6.13 68.53,53.75 | U5.13 32.36,53.76 32.35,53.75 | v67.81,15.77 64.47,15.77 | 64.47,15.77 59.11,15.77 J2.6 | v67.81,15.77 68.83,16.79 72.84,16.79 73.57,16.06 C7.2 | C1.2 116.39,10.75 116.39,6.74 115.4,5.75 114.67,5.75 114.08,5.16 114.08,2.03 114.89,1.22 116.5,1.22 117.37,2.08 | D1.C v125.31,2.22 132.03,2.22 135.3,5.5 135.3,7.21 135.45,7.37 | C3.2 126.91,5.36 U1.1 126.53,4.44 v125.9,4.44 | C2.2 143.2,7.41 R9.1 147.75,2.86 153.11,2.86 U8.15 153.14,2.12 154.05,1.22 162.15,1.22 | 162.15,1.22 182.95,1.22 190.55,8.82 J8.1 200.82,8.82 J7.1 208.2,6.04 208.2,24.51 208.71,25.01 208.75,25.02 208.81,25.12 209.35,25.65 210.57,25.65
  Top 0.406: C12.2 147.34,9.69 C13.2 148.71,8.38 157.76,8.38 162.15,3.99 162.15,1.22 | 17.12,44.14 17.12,53.69 17.06,53.75 | 48.21,42.93 48.21,53.73 48.23,53.75 | T47.2 167.44,53.74 167.45,53.75 | C8.2 66.34,10.35 64.45,12.25 64.45,15.75 64.47,15.77 | J1.1 108.73,14.35 109.16,14.77 | 101.77,8.79 102.83,9.85 v104.51,9.85
  Bottom 0.254: v55.52,21.18 57.83,21.18 58.79,20.23 58.79,16.23 J2.6 | v8.99,36.22 11.43,33.78 16.71,33.78 17.53,32.97 D3.3 | v181.91,32.16 v181.91,32.15
  Bottom 0.406: D3.3 18.22,32.19 40.11,32.19 40.82,31.48 46.27,31.48 D4.3 48.32,32.01 88.53,32.01 89.06,31.48 94.3,31.48 D5.3 96.23,32.13 117.95,32.13 118.56,31.52 124.31,31.52 D6.3 126.34,32.05 166.35,32.05 167.12,31.28 172.05,31.28 D7.3 174.27,32.15 v181.91,32.15 196.36,32.15 196.97,31.54 202.28,31.54 D8.3 | v125.9,4.44 125.31,3.85 v125.31,2.22 | v104.51,9.85 J9.1 | v80.25,2.69 80.89,2.05 v91.4,2.05
  pour Top (isolate 1.676): 0,61.47 0,0 215.9,0 215.9,61.47
  pour Bottom (isolate 1.676): 0,61.47 0,0 215.9,0 215.9,61.47
N$1  (via drill 0.35)
  Top 0.406: J1.5 106.13,7.88 v105.69,8.33 | v112.56,9.42 113.7,9.42 F1.1
  Bottom 0.406: v105.69,8.33 105.69,8.94 106.19,9.44 112.54,9.44 v112.56,9.42
N$2
  Top 0.254: U4.9 13.66,57.96 24.84,57.96 27.69,55.12 28.3,55.12 31.14,57.96 U5.14
N$3
  Top 0.254: U6.14 67.11,57.96 66.7,57.56 66.7,57.35 64.67,55.32 40.08,55.32 37.44,57.96 U5.9
N$4
  Top 0.254: Q1.3 70.23,15.9 71.85,15.9 C7.1 72.06,15.7 72.87,14.89 73.68,14.89 74.7,13.87 74.7,13.26 U2.7
N$5
  Top 0.254: D1.A 115.75,2.29 115.75,4.52 R1.1
N$6
  Top 0.254: 67.99,13.06 67.99,13.87 Q1.1 | 67.99,13.06 C8.1 | U2.8 71.24,13.26 71.04,13.06 67.99,13.06
N$7
  Top 0.254: U7.14 94.74,57.76 92.71,55.73 75.84,55.73 73.61,57.96 U6.9
N$8
  Top 0.254: D2.A 98.27,2.29 98.27,4.52 R2.1
N$9
  Top 0.254: 96.85,10.01 C11.1 96.71,13.16 97.03,13.48 U3.4
N$20
  Top 0.254: T10.3 22.2,26.26 21.59,26.26 20.17,27.69 N1.1
N$21
  Top 0.254: T8.3 23.62,30.12 21.39,30.12 21.18,30.33 N1.2
N$22
  Top 0.254: T7.3 23.22,34.19 21.59,34.19 20.98,33.58 N1.3
N$23
  Top 0.254: T6.3 20.78,37.64 19.15,36.02 N1.4
N$24
  Top 0.254: T5.3 17.12,39.67 17.12,37.85 16.51,37.24 N1.5
N$25
  Top 0.254: T4.3 12.85,39.67 12.85,37.85 13.46,37.24 N1.6
N$26
  Top 0.254: T3.3 9.4,37.64 11.02,36.02 N1.7
N$27
  Top 0.254: T2.3 6.96,34.19 8.59,34.19 9.2,33.58 N1.8
N$28
  Top 0.254: T1.3 6.35,30.12 8.59,30.12 8.79,30.33 N1.9
N$29
  Top 0.254: T9.3 7.77,26.26 8.38,26.26 9.8,27.69 N1.0
N$30
  Top 0.254: RN1.1 3.91,48.01 3.91,37.24 2.69,36.02 2.69,28.5 5.33,25.86 T9.1
N$31
  Top 0.254: RN1.2 4.72,48.01 4.72,37.44 3.1,35.81 3.1,31.75 3.91,30.94 T1.1
N$32  (via drill 0.35)
  Top 0.254: v5.54,45.77 5.54,48.01 RN1.3 | v5.54,37.03 5.54,36.42 5.13,36.02 T2.1
  Bottom 0.254: v5.54,37.03 v5.54,45.77
N$33
  Top 0.254: RN1.4 6.55,48.01 6.55,42.11 8.38,40.28 T3.1
N$34  (via drill 0.35)
  Top 0.254: v95.02,12.45 93.8,12.45 U3.9 | v90.95,12.45 89.94,13.46 R4.1
  Bottom 0.254: v90.95,12.45 v95.02,12.45
N$35
  Top 0.254: U3.8 93.15,12.98 91.22,14.91 90.3,14.91 89.91,15.3 R5.1
N$36
  Top 0.254: RN2.1 11.23,48.01 11.23,44.14 13.06,42.32 T4.1
N$37  (via drill 0.35)
  Top 0.254: v12.04,47.19 12.04,48.01 RN2.2 | v17.43,43.34 18.54,42.23 18.54,41.71 T5.1
  Bottom 0.254: v12.04,47.19 12.65,47.19 16.5,43.34 v17.43,43.34
N$38  (via drill 0.35)
  Top 0.254: v92.99,11.23 92.99,11.43 93.54,11.98 U3.10 | v91.16,11.43 89.94,11.43 C9.2
  Bottom 0.254: v92.99,11.23 91.36,11.23 v91.16,11.43
N$39
  Top 0.254: RN2.3 12.85,48.01 12.85,44.35 16.31,40.89 17.73,40.89 19.56,39.06 21.18,39.06 21.39,38.86 22.81,38.86 T6.1
N$40  (via drill 0.35)
  Top 0.254: v13.66,47.19 13.66,48.01 RN2.4 | v26.47,35.41 25.45,34.39 T7.1
  Bottom 0.254: v13.66,47.19 14.68,47.19 v26.47,35.41
N$43
  Top 0.254: R6.1 15.09,22.2 15.09,24.84 N1.A
N$44
  Top 0.254: RN3.1 27.89,48.21 27.89,30.94 25.86,28.9 T8.1
N$45  (via drill 0.35)
  Top 0.254: v28.7,27.89 28.7,48.21 RN3.2 | v25.04,24.23 23.62,24.23 T10.1
  Bottom 0.254: v25.04,24.23 v28.7,27.89
N$46
  Top 0.254: T22.3 52.07,26.26 51.46,26.26 50.24,27.48 N2.1
N$47
  Top 0.254: T21.3 53.7,30.12 51.46,30.12 51.26,30.33 N2.2
N$48
  Top 0.254: T20.3 53.09,34.19 51.66,34.19 50.85,33.38 N2.3
N$49
  Top 0.254: T19.3 50.85,37.64 49.02,35.81 N2.4
N$50
  Top 0.254: T18.3 46.99,39.67 46.99,37.64 46.58,37.24 N2.5
N$51
  Top 0.254: T17.3 42.93,39.67 42.93,37.64 43.33,37.24 N2.6
N$52
  Top 0.254: T16.3 39.27,37.64 39.27,37.24 40.69,35.81 N2.7
N$53
  Top 0.254: T15.3 36.83,34.19 38.25,34.19 39.07,33.38 N2.8
N$54
  Top 0.254: T14.3 36.42,30.12 38.46,30.12 38.66,30.33 N2.9
N$55
  Top 0.254: T13.3 37.85,26.26 38.66,26.26 39.88,27.48 N2.0
N$56
  Top 0.254: R7.1 44.96,22.2 44.96,24.84 N2.A
N$59
  Top 0.254: RN3.3 29.72,48.21 29.72,31.34 35.2,25.86 T13.1
N$60
  Top 0.254: RN3.4 30.53,48.21 30.53,42.32 33.17,39.67 33.17,31.34 33.78,30.73 T14.1
N$61
  Top 0.254: RN4.1 35,48.21 35,36.02 T15.1
N$62
  Top 0.254: RN4.2 36.02,48.21 36.02,42.52 38.25,40.28 T16.1
N$63
  Top 0.254: RN4.3 36.83,48.21 36.83,47.8 42.52,42.11 43.13,42.11 T17.1
N$64
  Top 0.254: RN4.4 37.64,48.21 38.86,48.21 46.18,40.89 47.8,40.89 48.41,41.5 T18.1
N$65
  Top 0.254: RN5.1 64.06,48.01 62.23,48.01 53.09,38.86 T19.1
N$66
  Top 0.254: RN5.2 64.87,48.01 64.87,43.33 55.73,34.19 T20.1
N$67
  Top 0.254: RN5.3 65.68,48.01 65.68,41.5 57.15,32.97 57.15,30.12 55.93,28.9 T21.1
N$68
  Top 0.254: RN5.4 66.5,48.01 66.5,41.71 57.56,32.77 57.56,28.9 55.52,26.87 54.1,26.87 53.49,26.26 53.49,26.06 53.29,25.86 53.29,24.23 T22.1
N$76
  Top 0.254: R8.1 147.24,15.9 150.29,15.9 150.9,16.51 161.87,16.51 163.09,17.73 U8.3
N$77
  Top 0.254: R9.2 147.24,5.13 150.09,5.13 150.9,4.32 153.74,4.32 155.17,2.9 U8.16
N$82
  Top 0.254: U9.14 116.69,57.76 116.28,57.35 116.28,57.15 114.05,54.92 104.09,54.92 101.24,57.76 U7.9
N$84
  Top 0.254: T32.3 100.03,26.26 99.42,26.26 98.2,27.48 N5.1
N$85
  Top 0.254: T31.3 101.65,30.12 99.42,30.12 99.21,30.33 N5.2
N$86
  Top 0.254: T30.3 101.04,34.19 99.42,34.19 98.81,33.58 N5.3
N$87
  Top 0.254: T29.3 98.81,37.64 97.18,36.02 N5.4
N$88
  Top 0.254: T28.3 95.15,39.67 95.15,37.85 94.54,37.24 N5.5
N$89
  Top 0.254: T27.3 90.88,39.67 90.88,37.85 91.49,37.24 N5.6
N$90
  Top 0.254: T26.3 87.43,37.85 87.43,37.44 88.85,36.02 N5.7
N$91
  Top 0.254: T25.3 84.78,34.19 86.61,34.19 87.22,33.58 N5.8
N$92
  Top 0.254: T24.3 84.38,30.12 86.61,30.12 86.82,30.33 N5.9
N$93
  Top 0.254: T23.3 85.8,26.26 86.61,26.26 87.83,27.48 N5.0
N$94
  Top 0.254: R10.1 93.12,22.2 93.12,24.84 N5.A
N$97
  Top 0.254: RN6.3 73,48.01 73,41.71 80.72,33.98 80.72,28.5 83.36,25.86 T23.1
N$98
  Top 0.254: RN6.4 73.81,48.01 73.81,42.32 81.13,35 81.13,31.55 81.94,30.73 T24.1
N$99
  Top 0.254: RN7.1 91.69,48.01 91.69,47.4 83.16,38.86 83.16,36.02 T25.1
N$100
  Top 0.254: RN7.2 92.51,48.01 92.51,45.16 90.27,42.93 90.27,41.5 90.47,41.3 90.47,40.89 90.27,40.69 89.66,40.69 89.26,40.28 86.61,40.28 T26.1
N$101
  Top 0.254: RN7.3 93.32,48.01 93.32,44.35 91.29,42.32 T27.1
N$102
  Top 0.254: RN7.4 94.34,48.01 94.34,44.35 96.57,42.11 96.57,41.71 T28.1
N$103
  Top 0.254: RN8.1 98.6,48.01 98.6,40.28 98.4,40.08 98.4,39.67 99.21,38.86 100.84,38.86 T29.1
N$104
  Top 0.254: RN8.2 99.62,48.01 99.62,42.32 104.29,37.64 104.29,34.8 103.68,34.19 T30.1
N$105  (via drill 0.35)
  Top 0.254: v100.43,42.52 100.43,48.01 RN8.3 | v103.68,32.97 105.1,31.55 105.1,30.12 103.89,28.9 T31.1
  Bottom 0.254: v100.43,42.52 100.43,36.22 v103.68,32.97
N$106
  Top 0.254: RN8.4 101.24,48.01 101.24,41.3 105.51,37.03 105.51,27.08 102.67,24.23 101.65,24.23 T32.1
N$117
  Top 0.254: T42.3 130.1,26.26 129.49,26.26 128.27,27.48 N6.1
N$118
  Top 0.254: T41.3 131.72,30.12 129.49,30.12 129.29,30.33 N6.2
N$119
  Top 0.254: T40.3 131.11,34.19 129.49,34.19 128.88,33.58 N6.3
N$120
  Top 0.254: T39.3 128.88,37.64 127.25,36.02 N6.4
N$121
  Top 0.254: T38.3 125.02,39.67 125.02,37.64 124.61,37.24 N6.5
N$122
  Top 0.254: T37.3 120.95,39.67 120.95,37.64 121.36,37.24 N6.6
N$123
  Top 0.254: T36.3 117.3,37.85 117.3,37.44 118.72,36.02 N6.7
N$124
  Top 0.254: T35.3 114.86,34.19 116.48,34.19 117.09,33.58 N6.8
N$125
  Top 0.254: T34.3 114.45,30.12 116.48,30.12 116.69,30.33 N6.9
N$126
  Top 0.254: T33.3 115.88,26.26 116.69,26.26 117.91,27.48 N6.0
N$127
  Top 0.254: R11.1 122.99,22.2 122.99,24.84 N6.A
N$130
  Top 0.254: RN9.1 113.84,48.01 113.84,40.28 110.79,37.24 110.79,28.5 113.44,25.86 T33.1
N$131
  Top 0.254: RN9.2 114.66,48.01 114.66,40.49 111.2,37.03 111.2,31.55 111.81,30.94 T34.1
N$132
  Top 0.254: RN9.3 115.47,48.01 115.47,40.69 113.23,38.46 113.23,36.02 T35.1
N$133
  Top 0.254: RN9.4 116.28,48.01 116.28,40.28 T36.1
N$134
  Top 0.254: RN10.1 121.36,48.01 121.36,42.32 T37.1
N$135
  Top 0.254: RN10.2 122.17,48.01 122.17,46.38 126.85,41.71 T38.1
N$136
  Top 0.254: RN10.3 122.99,48.01 122.99,47.8 129.49,41.3 129.9,41.3 130.91,40.28 130.91,38.86 T39.1
N$137
  Top 0.254: RN10.4 123.8,48.01 134.16,37.64 134.16,34.8 133.76,34.39 T40.1
N$138
  Top 0.254: RN11.1 142.09,48.01 142.09,39.88 135.18,32.97 135.18,30.12 133.96,28.9 T41.1
N$139
  Top 0.254: RN11.2 142.9,48.01 142.9,40.08 135.58,32.77 135.58,27.08 132.74,24.23 131.72,24.23 T42.1
N$150
  Top 0.254: T52.3 178.05,26.26 177.65,26.26 176.22,27.69 N7.1
N$151
  Top 0.254: T51.3 179.68,30.12 177.44,30.12 177.24,30.33 N7.2
N$152
  Top 0.254: T50.3 179.27,34.19 177.44,34.19 176.83,33.58 N7.3
N$153
  Top 0.254: T49.3 176.83,37.64 175.21,36.02 N7.4
N$154
  Top 0.254: T48.3 173.18,39.67 173.18,37.85 172.57,37.24 N7.5
N$155
  Top 0.254: T47.3 168.91,39.67 168.91,37.85 169.52,37.24 N7.6
N$156
  Top 0.254: T46.3 165.46,37.85 165.46,37.44 166.88,36.02 N7.7
N$157
  Top 0.254: T45.3 162.81,34.19 164.44,34.19 165.05,33.58 N7.8
N$158
  Top 0.254: T44.3 162.41,30.12 164.64,30.12 164.85,30.33 N7.9
N$159
  Top 0.254: T43.3 163.83,26.26 164.44,26.26 165.86,27.69 N7.0
N$160
  Top 0.254: R12.1 171.14,22.2 171.14,24.84 N7.A
N$163  (via drill 0.35)
  Top 0.254: v158.75,28.5 158.75,34.19 149,43.94 149,48.01 RN12.1 | v160.58,26.67 161.39,25.86 T43.1
  Bottom 0.254: v160.58,26.67 v158.75,28.5
N$164
  Top 0.254: RN12.2 149.81,48.01 149.81,46.18 159.16,36.83 159.16,31.75 159.97,30.94 T44.1
N$165
  Top 0.254: RN12.3 150.62,48.01 150.62,47.8 154.08,44.35 159.77,44.35 161.19,42.93 161.19,36.02 T45.1
N$166
  Top 0.254: RN12.4 151.44,48.01 156.72,48.01 164.44,40.28 T46.1
N$167
  Top 0.254: RN13.1 176.83,48.01 175.01,48.01 169.32,42.32 T47.1
N$168
  Top 0.254: RN13.2 177.65,48.01 177.65,44.55 174.8,41.71 T48.1
N$169
  Top 0.254: RN13.3 178.66,48.01 178.66,40.69 179.07,40.28 179.07,38.86 T49.1
N$170
  Top 0.254: RN13.4 179.48,48.01 179.48,39.88 182.32,37.03 182.32,35 181.71,34.39 T50.1
N$171
  Top 0.254: RN14.1 183.95,48.01 183.95,30.94 181.91,28.9 T51.1
N$172  (via drill 0.35)
  Top 0.254: v184.76,27.89 184.76,48.01 RN14.2 | v181.1,24.23 179.68,24.23 T52.1
  Bottom 0.254: v181.1,24.23 v184.76,27.89
N$183
  Top 0.254: T62.3 208.13,26.26 207.52,26.26 206.1,27.69 N8.1
N$184
  Top 0.254: T61.3 209.55,30.12 207.52,30.12 207.31,30.33 N8.2
N$185
  Top 0.254: T60.3 209.14,34.19 207.52,34.19 206.91,33.58 N8.3
N$186
  Top 0.254: T59.3 206.7,37.64 205.08,36.02 N8.4
N$187
  Top 0.254: T58.3 203.05,39.67 203.05,37.64 202.64,37.24 N8.5
N$188
  Top 0.254: T57.3 198.98,39.67 198.98,37.64 199.39,37.24 N8.6
N$189
  Top 0.254: T56.3 195.33,37.85 195.33,37.44 196.75,36.02 N8.7
N$190
  Top 0.254: T55.3 192.89,34.19 194.51,34.19 195.12,33.58 N8.8
N$191
  Top 0.254: T54.3 192.28,30.12 194.51,30.12 194.72,30.33 N8.9
N$192
  Top 0.254: T53.3 193.9,26.26 194.31,26.26 195.73,27.69 N8.0
N$193
  Top 0.254: R13.1 201.02,24.84 N8.A
N$196
  Top 0.254: RN14.3 185.78,48.01 185.78,31.34 191.26,25.86 T53.1
N$197
  Top 0.254: RN14.4 186.59,48.01 186.59,34.19 189.84,30.94 T54.1
N$198
  Top 0.254: RN15.1 201.02,48.21 193.29,40.49 193.29,39.88 194.31,38.86 194.31,38.46 191.87,36.02 191.06,36.02 T55.1
N$199
  Top 0.254: RN15.2 201.83,48.21 201.83,47.8 194.31,40.28 T56.1
N$200
  Top 0.254: RN15.3 202.64,48.21 202.64,45.36 199.39,42.11 T57.1
N$201
  Top 0.254: RN15.4 203.66,48.21 203.66,42.93 204.47,42.11 204.47,41.71 T58.1
N$202
  Top 0.254: RN16.1 208.13,48.21 208.13,41.1 208.94,40.28 208.94,38.86 T59.1
N$203  (via drill 0.35)
  Top 0.254: v208.94,41.3 208.94,48.21 RN16.2 | v208.94,36.42 210.97,34.39 211.58,34.39 T60.1
  Bottom 0.254: v208.94,36.42 v208.94,41.3
N$204
  Top 0.254: RN16.3 209.75,48.21 209.75,39.67 213.21,36.22 213.21,30.33 211.99,29.11 T61.1
N$205
  Top 0.254: RN16.4 210.57,48.21 210.57,39.47 213.82,36.22 213.82,27.28 210.77,24.23 209.55,24.23 T62.1
N$216
  Top 0.254: R14.2 64.67,36.42 67.11,36.42 67.31,36.22 N3.A
N$217
  Top 0.254: T11.3 73.2,36.42 70.97,36.42 70.76,36.22 N3.K
N$218
  Top 0.254: R15.2 64.87,25.86 67.11,25.86 67.31,25.65 N4.A
N$219
  Top 0.254: T12.3 73.2,25.86 70.97,25.86 70.76,25.65 N4.K
N$220
  Top 0.254: RN6.1 71.37,48.01 71.37,40.28 74.42,37.24 74.42,36.63 75.44,35.61 T11.1
N$221
  Top 0.254: RN6.2 71.98,48.21 71.98,48.62 71.78,48.82 70.76,48.82 69.54,47.6 69.54,31.55 74.42,26.67 74.42,26.06 75.44,25.04 T12.1
N$224
  Top 0.254: R16.2 142.9,36.63 145.14,36.63 145.34,36.42 N9.A
N$225
  Top 0.254: T63.3 151.23,36.63 149,36.63 148.79,36.42 N9.K
N$226
  Top 0.254: R17.2 142.7,26.06 145.14,26.06 145.34,25.86 N10.A
N$227
  Top 0.254: T64.3 151.23,26.06 149,26.06 148.79,25.86 N10.K
N$228
  Top 0.254: RN11.3 143.92,48.01 143.92,39.67 148.18,35.41 153.26,35.41 153.47,35.61 T63.1
N$229
  Top 0.254: RN11.4 144.73,48.01 144.73,44.96 152.45,37.24 152.45,37.03 152.86,36.63 154.48,36.63 154.69,36.42 154.69,29.92 152.45,27.69 152.45,26.26 153.47,25.25 T64.1
N$232
  Top 0.254: R19.1 150.09,13.67 150.9,14.48 163.9,14.48 167.15,17.73 U8.1
N$233
  Bottom 0.254: D4.4 47.4,29.72 44.15,29.72 42.93,30.94 39.88,30.94 39.27,31.55 13.66,31.55 12.45,32.77 D3.2
N$234
  Top 0.254: R18.1 149.88,7.16 150.69,6.35 155.78,6.35 159.23,2.9 U8.18
N$235  (via drill 0.35)
  Top 0.254: v45.57,32.77 v49.02,29.31
  Bottom 0.254: v49.02,29.31 87.22,29.31 88.44,30.53 91.29,30.53 92.1,29.72 95.56,29.72 D5.4 | v45.57,32.77 42.52,32.77 D4.2
N$236  (via drill 0.35)
  Top 0.254: v94.13,32.97 v95.56,31.55
  Bottom 0.254: v95.56,31.55 117.3,31.55 117.91,30.94 120.95,30.94 122.17,29.72 125.42,29.72 D6.4 | v94.13,32.97 90.47,32.97 D5.2
N$237  (via drill 0.35)
  Top 0.254: v124.21,32.77 v125.42,31.55
  Bottom 0.254: v125.42,31.55 165.25,31.55 166.06,30.73 169.11,30.73 170.13,29.72 173.58,29.72 D7.4 | v124.21,32.77 120.55,32.77 D6.2
N$238
  Bottom 0.254: D7.2 168.5,32.97 171.96,32.97 173.38,34.39 203.86,34.39 204.67,33.58 204.67,30.73 203.66,29.72 D8.4
N$241
  Top 0.254: U10.9 151.64,57.96 173.79,57.96 176.43,55.32 177.24,55.32 179.88,57.96 U11.14
N$248
  Top 0.254: U11.9 186.18,57.96 198.5,57.96 200.73,55.73 202.03,55.73 204.47,58.17 U12.14
N$256
  Top 0.254: U9.9 123.39,57.76 139.45,57.76 141.88,55.32 142.49,55.32 145.14,57.96 U10.14
REST  (via drill 0.35)
  Top 0.254: C11.2 94.81,10.01 89.33,4.52 87.5,4.52 S1.1 87.3,4.52 v84.86,4.52 | v78.15,9.4 81,9.4 U2.29 84.48,9.37 84.75,9.1 88.18,9.1 R3.2
  Bottom 0.254: J2.2 58.99,6.07 62.32,9.4 v78.15,9.4 83.03,4.52 v84.86,4.52
RX  (via drill 0.35)
  Top 0.254: v86.89,14.28 88.11,15.5 R5.2 | v82.83,10.21 81.2,10.21 U2.30
  Bottom 0.254: v82.83,10.21 v86.89,14.28
SHIELD  (5 unrouted)
  Top 0.254: 106.57,2.38 J1.P4 106.37,2.38 | 108.2,2.38 J1.P5
TX  (via drill 0.35)
  Top 0.254: v84.25,13.46 88.11,13.46 R4.2 | v82.22,11.43 81.81,11.03 81.2,11.03 U2.31
  Bottom 0.254: v82.22,11.43 v84.25,13.46
UD+
  Top 0.254: U3.1 105.89,11.98 107.43,10.43 J1.3
UD-  (via drill 0.35)
  Top 0.254: J1.4 106.78,9.88 105.36,11.31 v102.38,11.31 | v100.92,12.79 99.9,12.79 99.61,12.5 98.04,12.5 U3.2
  Bottom 0.254: v102.38,11.31 100.92,12.77 v100.92,12.79
VCC
  Top 0.406: J5.1 205.9,19.63 205.1,20.43 R13.2 R12.2 144.12,20.44 141.01,23.55 | 141.01,23.55 141.01,26.06 R17.1 140.98,36.64 R16.1 | 141.01,23.55 137.9,20.44 R11.2 R10.2 66.6,20.44 62.98,24.06 | 62.98,24.06 R15.1 | R15.1 | R15.1 62.98,36.49 R14.1 | 62.98,24.06 59.36,20.44 R7.2 R6.2